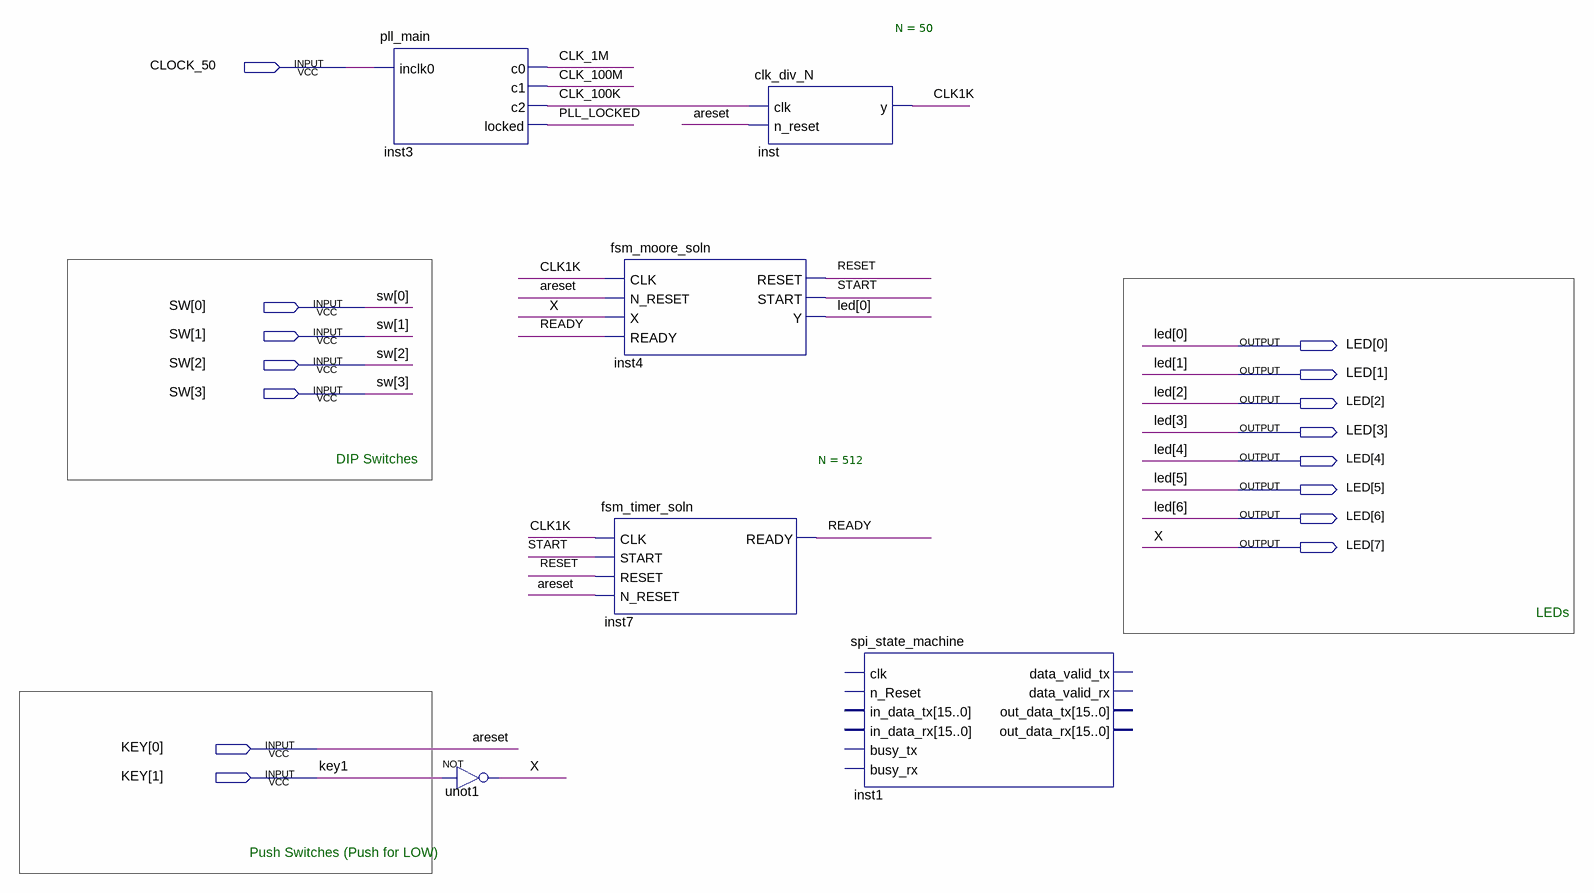
[diagram p0: schematic sheet]
// Quartus schematic TopLevelSchematic.bdf as structural Verilog: 6 symbols, 15 pins
module TopLevelSchematic (
  input  CLOCK_50,
  input  [3:0] SW,
  input  [1:0] KEY,
  output [7:0] LED
);

  wire CLK1K, CLK_1M, CLK_100K, CLK_100M, PLL_LOCKED, READY, RESET, START;

  pll_main inst3 (.inclk0(CLOCK_50), .c0(CLK_1M), .c1(CLK_100M), .c2(CLK_100K), .locked(PLL_LOCKED));
  not unot1 (LED[7], KEY[1]);
  fsm_moore_soln inst4 (
    .CLK(CLK1K), .N_RESET(KEY[0]), .X(LED[7]), .READY(READY), .RESET(RESET), .START(START), .Y(LED[0]));
  fsm_timer_soln #(.N(512)) inst7 (.CLK(CLK1K), .START(START), .RESET(RESET), .N_RESET(KEY[0]), .READY(READY));
  clk_div_N #(.N(50)) inst (.clk(CLK_100K), .n_reset(KEY[0]), .y(CLK1K));
  spi_state_machine inst1 ();  // open: clk, n_Reset, in_data_tx, in_data_rx, busy_tx, busy_rx, data_valid_tx, data_valid_rx, out_data_tx, out_data_rx

  // Other names for the same wires on the sheet: areset = KEY[0]; X = LED[7]

  // Notes on the sheet:
  //   DIP Switches
  //   LEDs
  //   Push Switches (Push for LOW)
endmodule
